# Altium schematic sheet LAUNCHXL-F28069_B_1400922_2.SchDoc: LAUNCHXL-F28069_B_1400922
size 301 x 234 mm; Origin: Eagle; Date: 2023/6/4 16:46:29; SheetNumber: 3; GateName_1: G$1; SymbolName_1: FRAME_A_L; LibraryName: frames; DeviceSetName: FRAME_A_L; GateName_2: G$2; SymbolName_2: DOCFIELD; Sheet: Sheet:; REV: REV:; COMPANY: COMPANY:; Scale:1/1: Scale: 1/1; Drawn: Drawn; Checked: Checked; Approved: Approved; Embest: Embest
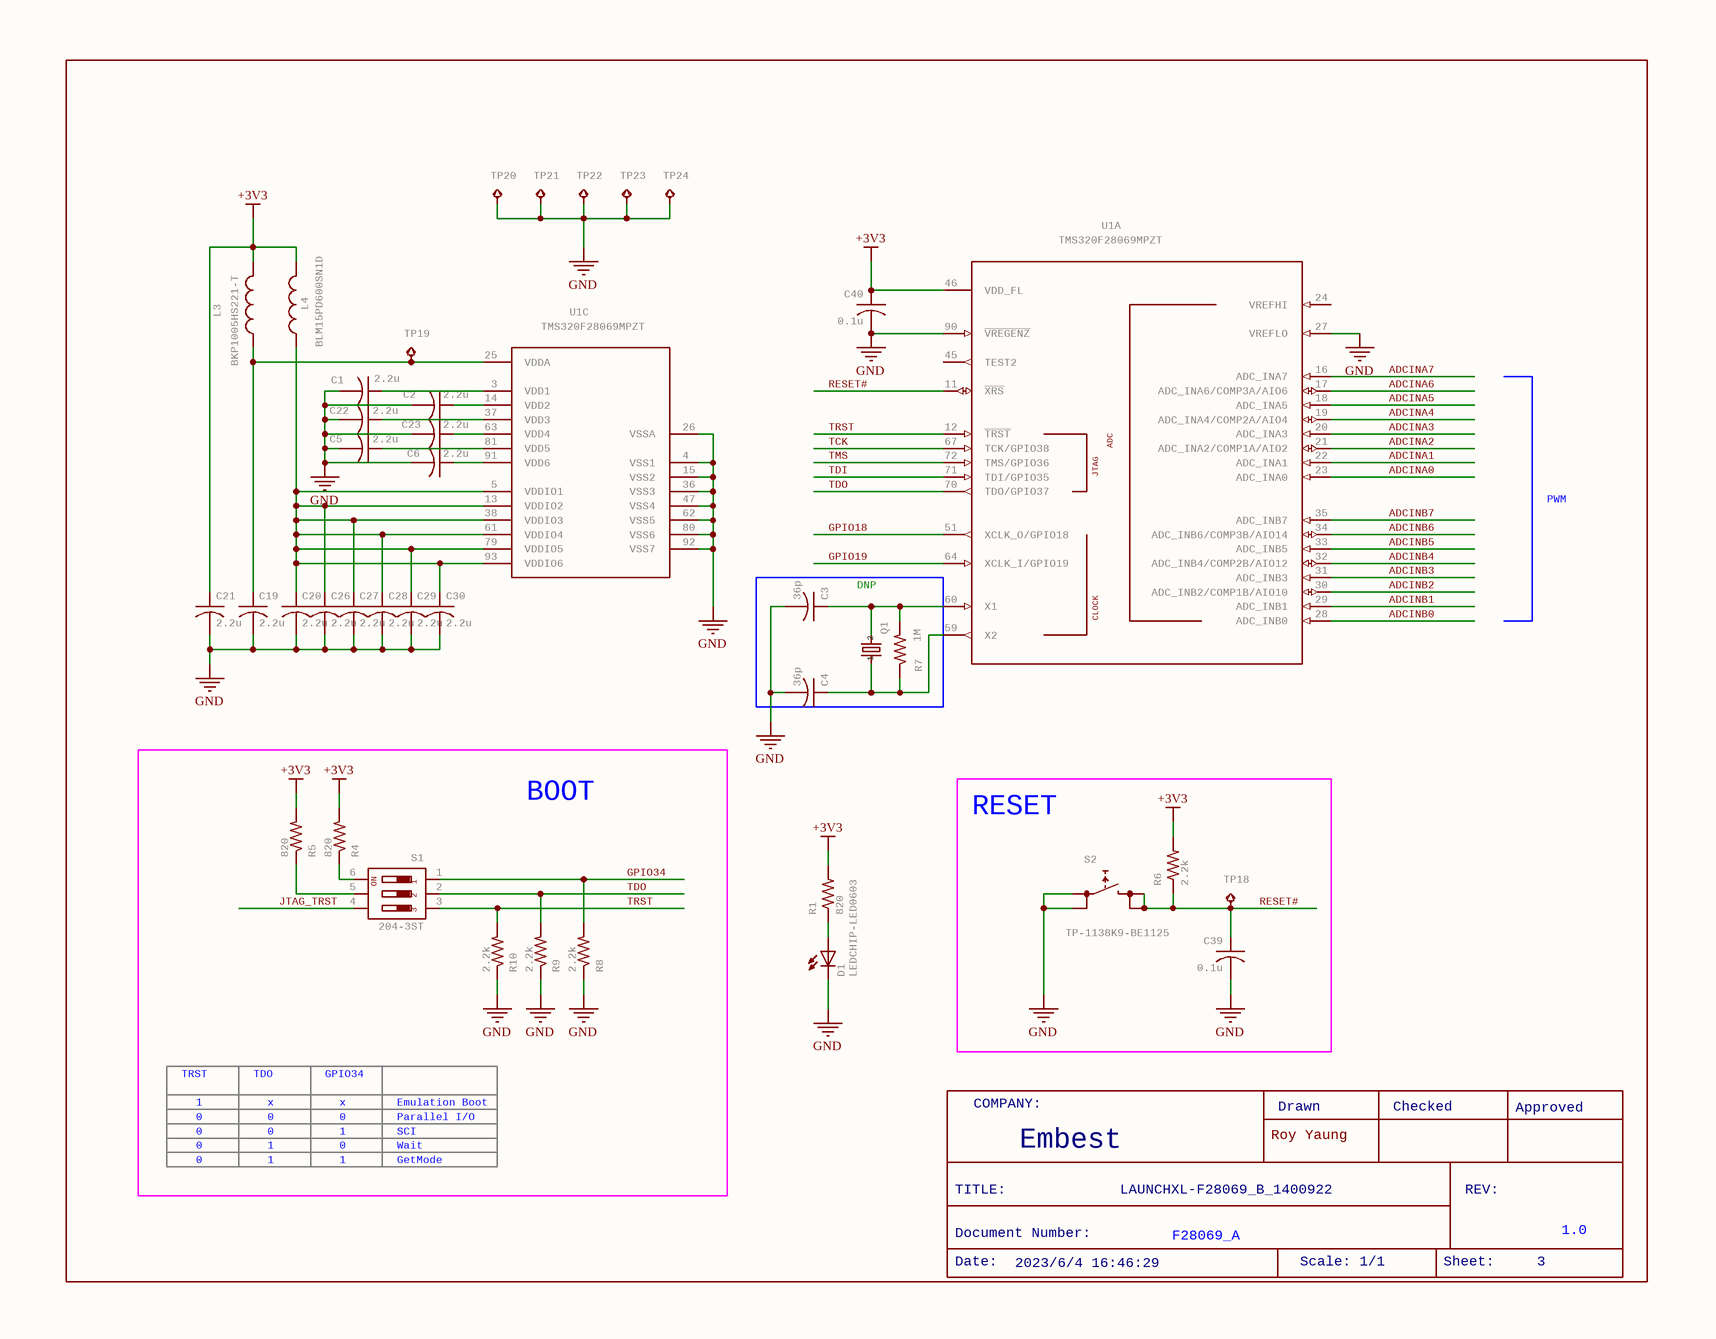
[diagram p0: LAUNCHXL-F28069_B_1400922_2.SchDoc]

## Parts
C1  2.2u  [C0402]
C2  2.2u  [C0402]
C3  36p  [C0402]
C4  36p  [C0402]
C5  2.2u  [C0402]
C6  2.2u  [C0402]
C19  2.2u  [C0402]
C20  2.2u  [C0402]
C21  2.2u  [C0402]
C22  2.2u  [C0402]
C23  2.2u  [C0402]
C26  2.2u  [C0402]
C27  2.2u  [C0402]
C28  2.2u  [C0402]
C29  2.2u  [C0402]
C30  2.2u  [C0402]
C39  0.1u  [C0402]
C40  0.1u  [C0402]
D1  LEDCHIP-LED0603  [CHIP-LED0603]
L3  BKP1005HS221-T  [R0402]
L4  BLM15PD600SN1D  [R0402]
Q1  CRYSTALHC49S  [HC49/S]  (value not drawn)
R1  820  [R0402]
R4  820  [R0402]
R5  820  [R0402]
R6  2.2k  [R0402]
R7  1M  [R0402]
R8  2.2k  [R0402]
R9  2.2k  [R0402]
R10  2.2k  [R0402]
S1  204-3ST  [CTS-219-03]
S2  TP-1138K9-BE1125  [FSMJSMA]
TP18  TESTPAD_TPB1,27  [TESTPAD_B1,27]  (value not drawn)
TP19  TESTPAD_TPB1,27  [TESTPAD_B1,27]  (value not drawn)
TP20  TESTPAD_TPB1,27  [TESTPAD_B1,27]  (value not drawn)
TP21  TESTPAD_TPB1,27  [TESTPAD_B1,27]  (value not drawn)
TP22  TESTPAD_TPB1,27  [TESTPAD_B1,27]  (value not drawn)
TP23  TESTPAD_TPB1,27  [TESTPAD_B1,27]  (value not drawn)
TP24  TESTPAD_TPB1,27  [TESTPAD_B1,27]  (value not drawn)
U1  TMS320F28069MPZT  [PQFP100]  (parts A,C of 3)

## Blocks framed on the sheet
DNP: C3 C4 Q1 R7
BOOT: R4 R5 R8-R10 S1
RESET: C39 R6 S2 TP18

## Nets
+3V3: C21.1 C40.1 L3.2 L4.2 R1.2 R4.2 R5.2 R6.2 U1.46(VDD_FL)
GND: C1.2 C2.2 C3.2 C4.2 C5.2 C6.2 C19.2 C20.2 C21.2 C22.2 C23.2 C26.2 C27.2 C28.2 C29.2 C30.2 C39.2 C40.2 D1.C R8.1 R9.1 R10.1 S2.P$1 S2.P$2 TP20.TP TP21.TP TP22.TP TP23.TP TP24.TP U1.4(VSS1) U1.15(VSS2) U1.26(VSSA) U1.27(VREFLO) U1.36(VSS3) U1.47(VSS4) U1.62(VSS5) U1.80(VSS6) U1.90(~{VREGENZ}) U1.92(VSS7)
ADCINA0: U1.23(ADC_INA0)
ADCINA1: U1.22(ADC_INA1)
ADCINA2: U1.21(ADC_INA2/COMP1A/AIO2)
ADCINA3: U1.20(ADC_INA3)
ADCINA4: U1.19(ADC_INA4/COMP2A/AIO4)
ADCINA5: U1.18(ADC_INA5)
ADCINA6: U1.17(ADC_INA6/COMP3A/AIO6)
ADCINA7: U1.16(ADC_INA7)
ADCINB0: U1.28(ADC_INB0)
ADCINB1: U1.29(ADC_INB1)
ADCINB2: U1.30(ADC_INB2/COMP1B/AIO10)
ADCINB3: U1.31(ADC_INB3)
ADCINB4: U1.32(ADC_INB4/COMP2B/AIO12)
ADCINB5: U1.33(ADC_INB5)
ADCINB6: U1.34(ADC_INB6/COMP3B/AIO14)
ADCINB7: U1.35(ADC_INB7)
GPIO18: U1.51(XCLK_O/GPIO18)
GPIO19: U1.64(XCLK_I/GPIO19)
GPIO34: R8.2 S1.1
JTAG_TRST: S1.4
RESET#: C39.1 R6.1 S2.P$3 S2.P$4 TP18.TP U1.11(~{XRS})
TCK: U1.67(TCK/GPIO38)
TDI: U1.71(TDI/GPIO35)
TDO: R9.2 S1.2 U1.70(TDO/GPIO37)
TMS: U1.72(TMS/GPIO36)
TRST: R10.2 S1.3 U1.12(~{TRST})
NetC1_1: C1.1 U1.3(VDD1)
NetC2_1: C2.1 U1.14(VDD2)
NetC3_1: C3.1 Q1.2 R7.2 U1.60(X1)
NetC4_1: C4.1 Q1.1 R7.1 U1.59(X2)
NetC5_1: C5.1 U1.81(VDD5)
NetC6_1: C6.1 U1.91(VDD6)
NetC19_1: C19.1 L3.1 TP19.TP U1.25(VDDA)
NetC20_1: C20.1 C26.1 C27.1 C28.1 C29.1 C30.1 L4.1 U1.5(VDDIO1) U1.13(VDDIO2) U1.38(VDDIO3) U1.61(VDDIO4) U1.79(VDDIO5) U1.93(VDDIO6)
NetC22_1: C22.1 U1.37(VDD3)
NetC23_1: C23.1 U1.63(VDD4)
NetD1_A: D1.A R1.1
NetR4_1: R4.1 S1.6
NetR5_1: R5.1 S1.5

Not connected (* = marked no-connect by the designer): U1 24(VREFHI) 45(TEST2)

## Notes on the sheet
- PWM
- TRST
- TDO
- GPIO34
- 1
- 0
- x
- Emulation Boot
- Parallel I/O
- SCI
- Wait
- COMPANY:
- Roy Yaung
- Drawn
- Checked
- Approved
- GetMode
- TITLE:
- Embest
- LAUNCHXL-F28069_B_1400922
- REV:
- Date:
- Document Number:
- 2023/6/4 16:46:29
- F28069_A
- Scale: 1/1
- Sheet:
- 3
- 1.0

## Library data of the parts
C1-C6 C19-C23 C26-C30 C39 C40 = C-USC0402: CAPACITOR, American symbol; GateName_1: G$1; SymbolName_1: C-US; DeviceName: C0402; LibraryName: rcl; DeviceSetName: C-US
D1 = LEDCHIP-LED0603: LED   OSRAM: - CHIPLED LG R971, LG N971, LY N971, LG Q971, LY Q971, LO R971, LY R971 LH N974, LH R974 LS Q976, LO Q976, LY Q976 LO Q996 - Hyper CHIPLED LW Q18S LB Q993, LB Q99A, LB R99A - SideLED LS A670, LO A670, LY A670, LG A670, LP A670 LB A673, LV A673, LT A673, LW A673 LH A674 LY A675 LS A676, LA A676, LO A676, LY A676, LW A676 LS A679, LY A679, LG A679 -  Hyper Micro SIDELED庐 LS Y876, LA Y876, LO Y876, LY Y876 LT Y87S - SmartLED LW L88C, LW L88S LB L89C, LB L89S, LG L890 LS L89K, LO L89K, LY L89K LS L896, LA L896, LO L896, LY L896 - TOPLED LS T670, LO T670, LY T670, LG T670, LP T670 LSG T670, LSP T670, LSY T670, LOP T670, LYG T670 LG T671, LOG T671, LSG T671 LB T673, LV T673, LT T673, LW T673 LH T674 LS T676, LA T676, LO T676, LY T676, LB T676, LH T676, LSB T676, LW T676 LB T67C, LV T67C, LT T67C, LS T67K, LO T67K, LY T67K, LW E67C LS E67B, LA E67B, LO E67B, LY E67B, LB E67C, LV E67C, LT E67C LW T67C LS T679, LY T679, LG T679 LS T770, LO T770, LY T770, LG T770, LP T770 LB T773, LV T773, LT T773, LW T773 LH T774 LS E675, LA E675, LY E675, LS T675 LS T776, LA T776, LO T776, LY T776, LB T776 LHGB T686 LT T68C, LB T68C - Hyper Mini TOPLED庐 LB M676 - Mini TOPLED Santana庐 LG M470 LS M47K, LO M47K, LY M47K    Source: http://www.osram.convergy.de   LUXEON: - LUMILED庐 LXK2-PW12-R00, LXK2-PW12-S00, LXK2-PW14-U00, LXK2-PW14-V00 LXK2-PM12-R00, LXK2-PM12-S00, LXK2-PM14-U00 LXK2-PE12-Q00, LXK2-PE12-R00, LXK2-PE12-S00, LXK2-PE14-T00, LXK2-PE14-U00 LXK2-PB12-K00, LXK2-PB12-L00, LXK2-PB12-M00, LXK2-PB14-N00, LXK2-PB14-P00, LXK2-PB14-Q00 LXK2-PR12-L00, LXK2-PR12-M00, LXK2-PR14-Q00, LXK2-PR14-R00 LXK2-PD12-Q00, LXK2-PD12-R00, LXK2-PD12-S00 LXK2-PH12-R00, LXK2-PH12-S00 LXK2-PL12-P00, LXK2-PL12-Q00, LXK2-PL12-R00    Source: www.luxeon.com   KINGBRIGHT:   KA-3528ASYC Source: www.kingbright.com; GateName_1: G$1; SymbolName_1: LED; DeviceName: CHIP-LED0603; LibraryName: led; DeviceSetName: LED
L3 L4 = L-US0402: INDUCTOR, American symbol; GateName_1: G$1; SymbolName_1: L-US; DeviceName: 0402; LibraryName: rcl; DeviceSetName: L-US
Q1 = CRYSTALHC49S: CRYSTAL; GateName_1: G$1; SymbolName_1: Q; DeviceName: HC49S; LibraryName: crystal; DeviceSetName: CRYSTAL; 1: 1; 2: 2; MF: MF; MPN: MPN; OC_FARNELL: 1667008; OC_NEWARK: unknown
R1 R4-R10 = R-US_R0402: RESISTOR, American symbol; GateName_1: G$1; SymbolName_1: R-US; DeviceSetName: R-US_; DeviceName: R0402; LibraryName: rcl
S1 = 219-03*: Surface Mount DIP Switch Series 219 SMT   CTS Electronic Components Sourc: www.ctscorp.com; GateName_1: G$1; SymbolName_1: DIP03; LibraryName: switch-dil; DeviceSetName: 219-03*; 1: 1; 2: 2; 3: 3; ON: ON; MF: MF; MPN: MPN; OC_FARNELL: unknown; OC_NEWARK: unknown
S2 = FSMJSMA: GateName_1: G$1; SymbolName_1: NORMOPEN; LibraryName: switch; DeviceSetName: FSMJSMA
TP18-TP24 = TESTPAD_TPB1,27: Test pad; GateName_1: G$1; DeviceName: B1,27; SymbolName_1: TESTPAD_TP; LibraryName: RF430FRL152H_EVM_a; DeviceSetName: TESTPAD_TP
U1 = TMS320F28069PZSR: GateName_1: G$1; SymbolName_1: TI_TMSF2806X_FUN; GateName_2: G$2; SymbolName_2: TI_TMSF2806X_IO; GateName_3: G$3; SymbolName_3: TI_TMSF2806X_PW; DeviceName: R; LibraryName: LAUNCHXL-F28027; DeviceSetName: TMS320F28069PZS; JTAG: JTAG; CLOCK: CLOCK; ADC: ADC